# Altium schematic sheet Traiak.SchDoc
size A
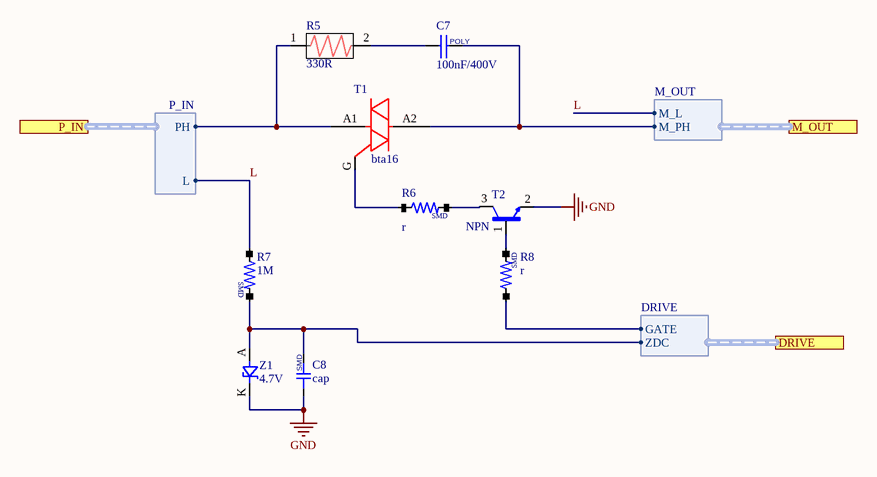
[diagram p0: Traiak.SchDoc]

## Parts
C7  100nF/400V  [CAP/100nF/275V/poly]
C8  cap  [CAP-0805]
R5  330R  [RES/1W]
R6  r  [RES/0805]
R7  1M  [RES/0805]
R8  r  [RES/0805]
T1  bta16  [bta16]
T2  NPN  [SOT23]
Z1  4.7V  [DIOD/RS1J]

## Ports
DRIVE (harness DRIVE), M_OUT (harness M_OUT), P_IN (harness P_IN)

## Harnesses
P_IN: L, PH
M_OUT: M_L, M_PH
DRIVE: GATE, ZDC

## Nets
GND: C8.1 T2.2(E) Z1.K
L: R7.1 ; port P_IN.L, port M_OUT.M_L
NetC7_1: C7.1 R5.2
NetC7_2: C7.2 T1.A2 ; port M_OUT.M_PH
NetC8_2: C8.2 R7.2 Z1.A ; port DRIVE.ZDC
NetR5_1: R5.1 T1.A1 ; port P_IN.PH
NetR6_1: R6.1 T1.G
NetR6_2: R6.2 T2.3(C)
NetR8_1: R8.1 ; port DRIVE.GATE
NetR8_2: R8.2 T2.1(B)

## Notes on the sheet
- (in symbol cap-poly) POLY
- (in symbol cap_smd) SMD
- (in symbol RES/SMD) SMD

## Library data of the parts
C7 = cap-poly
C8 = cap_smd
R5 = RES/>=1W
R6-R8 = RES/SMD
Z1 = zener-0.5w